# EAGLE design zinthesizer (EAGLE 7.7.0)
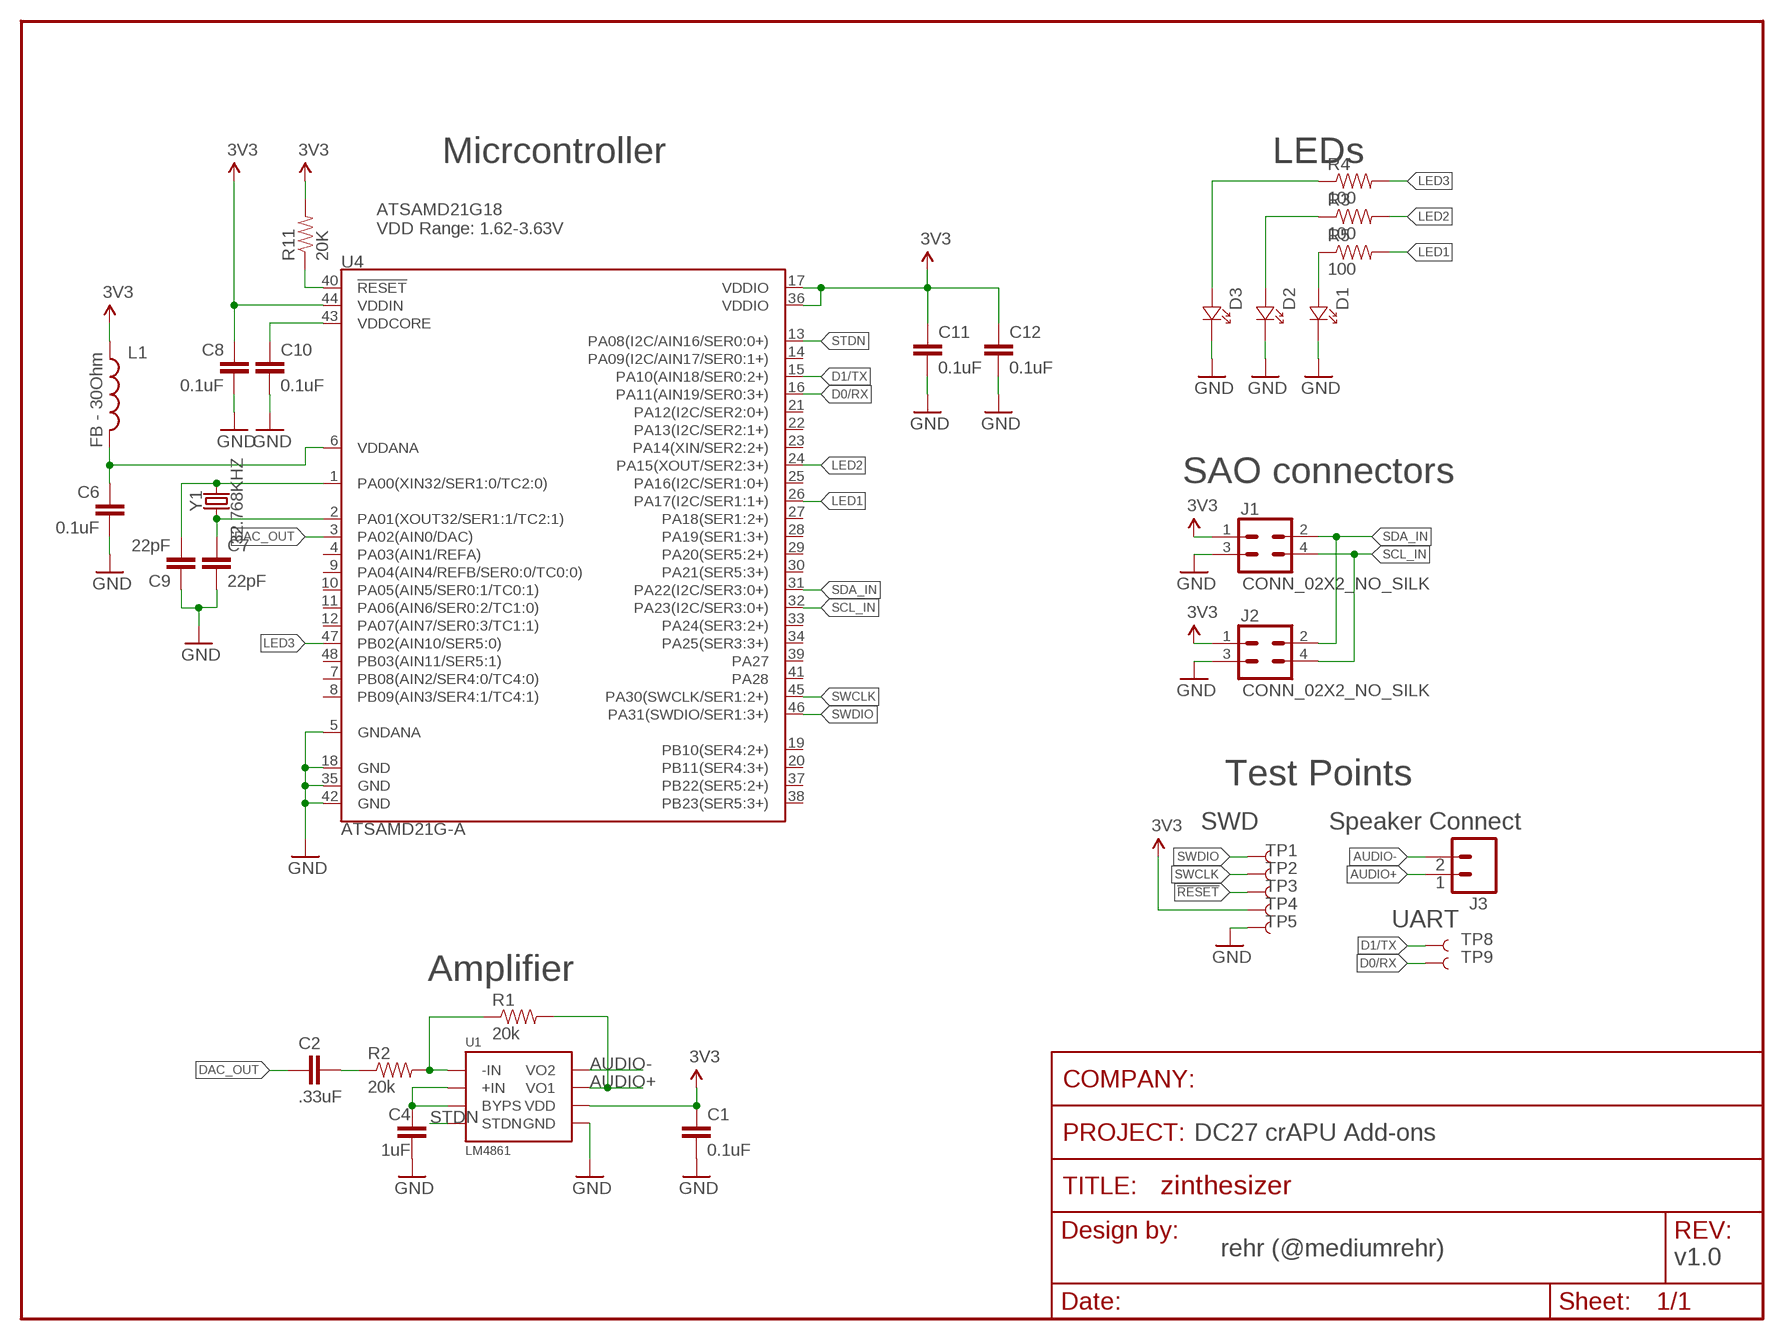
[diagram p0: schematic, sheet 1]

## Parts
C1  0.1uF  CAP0603-CAP  [0603-CAP]
C2  .33uF  CAP0603-CAP  [0603-CAP]
C4  1uF  CAP0603-CAP  [0603-CAP]
C6  0.1uF  0.1UF-25V(+80/-20%)(0603)  [0603-CAP]
C7  22pF  15PF-50V-5%(0603)  [0603-CAP]
C8  0.1uF  0.1UF-25V(+80/-20%)(0603)  [0603-CAP]
C9  22pF  15PF-50V-5%(0603)  [0603-CAP]
C10  0.1uF  0.1UF-25V(+80/-20%)(0603)  [0603-CAP]
C11  0.1uF  0.1UF-25V(+80/-20%)(0603)  [0603-CAP]
C12  0.1uF  0.1UF-25V(+80/-20%)(0603)  [0603-CAP]
D1  LED1206REVERSE_NO_SILK  [1206_NO_SILK]
D2  LED1206REVERSE_NO_SILK  [1206_NO_SILK]
D3  LED1206REVERSE_NO_SILK  [1206_NO_SILK]
FRAME1  FRAME-LETTER-BLANKNO_PACKAGE  [DUMMY]
J1  CONN_02X2_NO_SILK  [2X2_NO_SILK]
J2  CONN_02X2_NO_SILK  [2X2_NO_SILK]
J3  M02ROUND  [M02_ROUND]
L1  FB - 30Ohm  INDUCTOR0603  [0603]
R1  20k  RESISTOR0805-RES  [0805]
R2  20k  RESISTOR0805-RES  [0805]
R3  100  10KOHM-1/10W-1%(0603)0603  [0603-RES]
R4  100  10KOHM-1/10W-1%(0603)0603  [0603-RES]
R5  100  10KOHM-1/10W-1%(0603)0603  [0603-RES]
R11  20K  10KOHM-1/10W-1%(0603)0603  [0603-RES]
TP1  TEST-POINT3X5  [PAD.03X.05]
TP2  TEST-POINT3X5  [PAD.03X.05]
TP3  TEST-POINT3X5  [PAD.03X.05]
TP4  TEST-POINT3X5  [PAD.03X.05]
TP5  TEST-POINT3X5  [PAD.03X.05]
TP8  TEST-POINT3X4  [PAD.03X.04]
TP9  TEST-POINT3X4  [PAD.03X.04]
U1  LM4861  [8-SOIC]
U4  ATSAMD21G-A  [TQFP-48]
Y1  32.768KHZ  ABS06-127-32.768KHZ  [ABS06]

## Nets
3.3V: C1.1 C8.1 C11.1 C12.1 J1.1 J2.1 L1.1 R11.2 TP4.P$1 U1.P$6(VDD) U4.17(VDDIO) U4.36(VDDIO) U4.44(VDDIN) ; supply symbol labelled 3V3
!RESET: R11.1 TP3.P$1 U4.40(!RESET!)
AUDIO+: J3.P$1 R1.2 U1.P$5(VO1)
AUDIO-: J3.P$2 U1.P$8(VO2)
D0/RX: TP9.P$1 U4.16(PA11(AIN19/SER0:3+))
D1/TX: TP8.P$1 U4.15(PA10(AIN18/SER0:2+))
DAC_OUT: C2.2 U4.3(PA02(AIN0/DAC))
GND: C1.2 C4.2 C6.2 C7.2 C8.2 C9.1 C10.2 C11.2 C12.2 D1.P$1 D2.P$1 D3.P$1 J1.3 J2.3 TP5.P$1 U1.P$7(GND) U4.5(GNDANA) U4.18(GND) U4.35(GND) U4.42(GND)
LED1: R5.2 U4.26(PA17(I2C/SER1:1+))
LED2: R3.2 U4.24(PA15(XOUT/SER2:3+))
LED3: R4.2 U4.47(PB02(AIN10/SER5:0))
N$1: C2.1 R2.1
N$2: R1.1 R2.2 U1.P$4(-IN)
N$3: D1.P$2 R5.1
N$4: C7.1 U4.2(PA01(XOUT32/SER1:1/TC2:1)) Y1.P$1
N$5: C4.1 U1.P$2(BYPS) U1.P$3(+IN)
N$6: D2.P$2 R3.1
N$7: D3.P$2 R4.1
N$9: C9.2 U4.1(PA00(XIN32/SER1:0/TC2:0)) Y1.P$2
SCL_IN: J1.4 J2.4 U4.32(PA23(I2C/SER3:0+))
SDA_IN: J1.2 J2.2 U4.31(PA22(I2C/SER3:0+))
STDN: U1.P$1(STDN) U4.13(PA08(I2C/AIN16/SER0:0+))
SWCLK: TP2.P$1 U4.45(PA30(SWCLK/SER1:2+))
SWDIO: TP1.P$1 U4.46(PA31(SWDIO/SER1:3+))
VDDANA: C6.1 L1.2 U4.6(VDDANA)
VDDCORE: C10.1 U4.43(VDDCORE)
Unconnected: U4.4(PA03(AIN1/REFA)) U4.7(PB08(AIN2/SER4:0/TC4:0)) U4.8(PB09(AIN3/SER4:1/TC4:1)) U4.9(PA04(AIN4/REFB/SER0:0/TC0:0)) U4.10(PA05(AIN5/SER0:1/TC0:1)) U4.11(PA06(AIN6/SER0:2/TC1:0)) U4.12(PA07(AIN7/SER0:3/TC1:1)) U4.14(PA09(I2C/AIN17/SER0:1+)) U4.19(PB10(SER4:2+)) U4.20(PB11(SER4:3+)) U4.21(PA12(I2C/SER2:0+)) U4.22(PA13(I2C/SER2:1+)) U4.23(PA14(XIN/SER2:2+)) U4.25(PA16(I2C/SER1:0+)) U4.27(PA18(SER1:2+)) U4.28(PA19(SER1:3+)) U4.29(PA20(SER5:2+)) U4.30(PA21(SER5:3+)) U4.33(PA24(SER3:2+)) U4.34(PA25(SER3:3+)) U4.37(PB22(SER5:2+)) U4.38(PB23(SER5:3+)) U4.39(PA27) U4.41(PA28) U4.48(PB03(AIN11/SER5:1))

## Notes on the sheet
- Micrcontroller | LEDs
- ATSAMD21G18
  VDD Range: 1.62-3.63V
- SAO connectors
- Test Points
- SWD | Speaker Connect
- UART
- Amplifier
- DC27 crAPU Add-ons
- rehr (@mediumrehr)
- v1.0

## Library data of the parts
C1 C2 C4 = SparkFun-Passives:CAP: Capacitor Standard 0603 ceramic capacitor, and 0.1" leaded capacitor.
C6 C8 C10-C12 = SparkFun-Capacitors:0.1UF-25V(+80/-20%)(0603): CAP-00810 Ceramic Standard decoupling cap; PROD_ID: CAP-00810
C7 C9 = SparkFun-Capacitors:15PF-50V-5%(0603): CAP-07881; PROD_ID: CAP-07881; VALUE: 15pF
D1-D3 = IDEO-Diodes:LED1206
FRAME1 = SparkFun-Aesthetics:FRAME-LETTER-BLANK: Schematic Frame - Letter Standard 8.5x11 US Letter frame; DESIGNER: Nobody; VERSION: v01
J1 J2 = SparkFun-Connectors:CONN_02X2
J3 = IDEO-Connectors:M02
L1 = SparkFun-Passives:INDUCTOR: Inductors Basic Inductor/Choke - 0603 and 1206. Footprints are not proven and vary greatly between part numbers. INDUCTOR POWER 3.3UH 4.0A SMD 0.197" L x 0.197" W x 0.177" H (5.00mm x 5.00mm x 4.50mm); PROD_ID: RES-07859
R1 R2 = SparkFun-Passives:RESISTOR: Resistor Basic schematic elements and footprints for 0603, 1206, and PTH resistors.
R3-R5 R11 = SparkFun-Resistors:10KOHM-1/10W-1%(0603): RES-00824; PROD_ID: RES-00824; VALUE: 10K
TP1-TP5 TP8 TP9 = SparkFun-Connectors:TEST-POINT: SparkFun Test Points Bare copper test points for troubleshooting or In-Circuit-Testing. These are used by our Production team for verifying production board runs using pogo-pins on test beds. SparkFun Products: SparkFun LSM9DS1 Breakout <https://www.sparkfun.com/products/13284> SparkFun PSOC <https://www.sparkfun.com/products/13714> SparkFun Load Cell Amplifier <https://www.sparkfun.com/products/13879>
U1 = IDEO-ICs:LM4861
U4 = samd21-temp:ATSAMD21G: Atmel SAMD21G SMART ARM-Based Microcontroller The Atmel ® | SMART ™ SAM D21 is a series of low-power microcontrollers using the 32-bit ARM ® Cortex ® -M0+ processor, and ranging from 32- to 64-pins with up to 256KB Flash and 32KB of SRAM. The SAM D21 devices operate at a maximum frequency of 48MHz and reach 2.46 CoreMark/MHz. They are designed for simple and intuitive migration with identical peripheral modules, hex compatible code, identical linear address map and pin compatible migration paths between all devices in the product series. All devices include intelligent and flexible peripherals, Atmel Event System for inter-peripheral signaling, and support for capacitive touch button, slider and wheel user interfaces.; PROD_ID: IC-13064
Y1 = IDEO-Clocks:ABS06-127-32.768KHZ

## Board
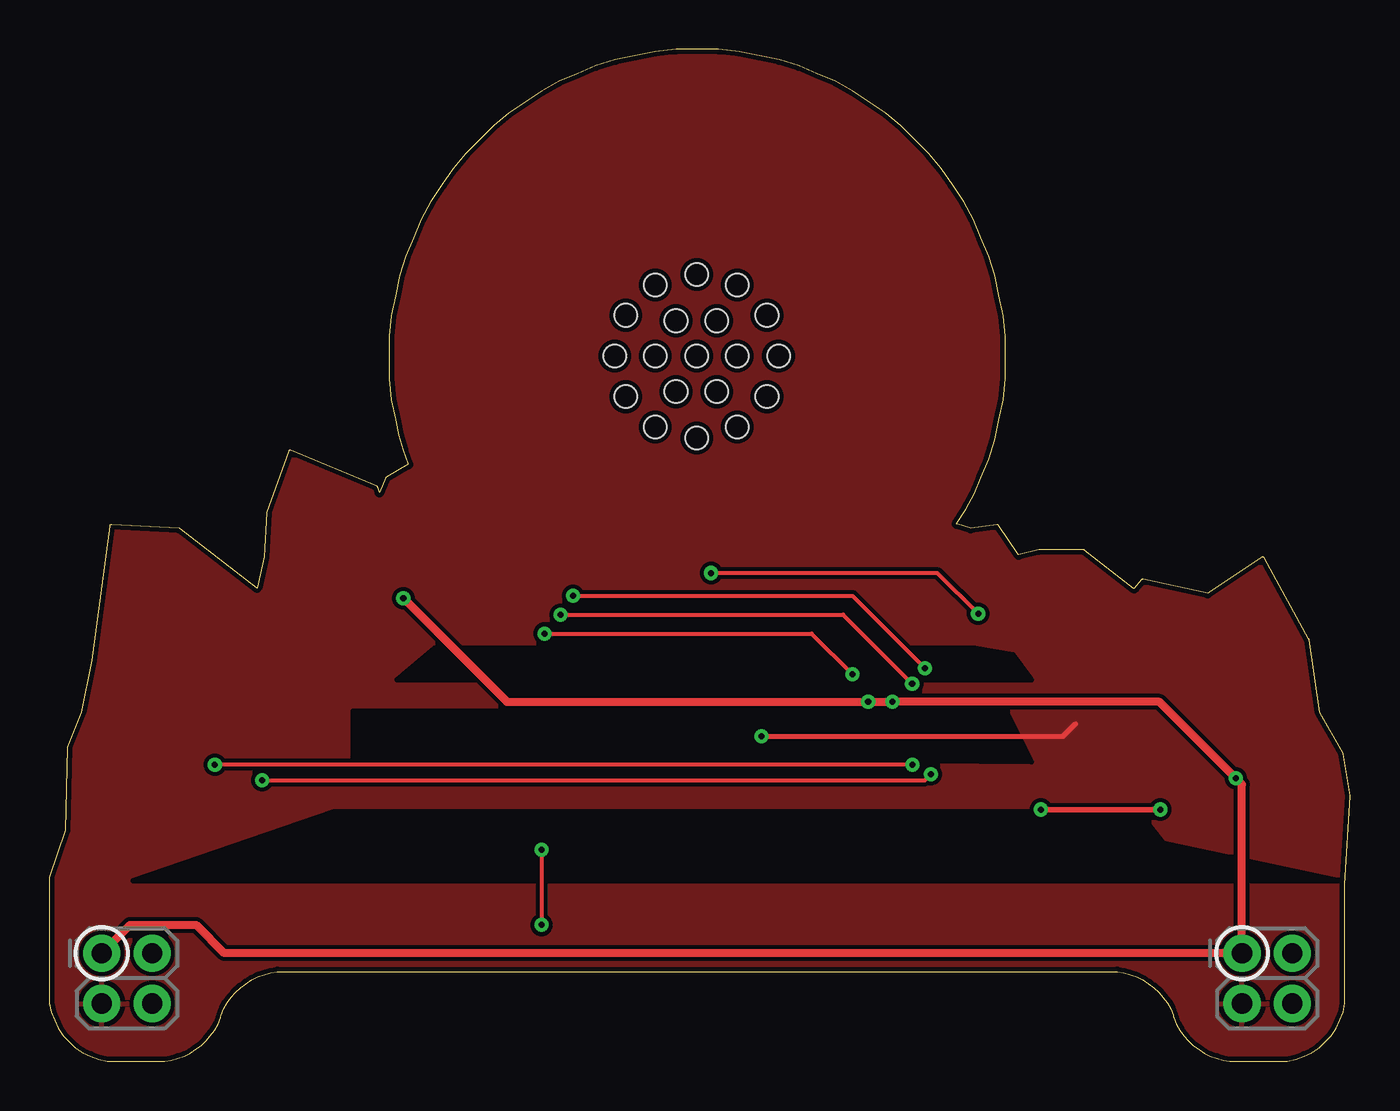
[diagram p1: board, top side]
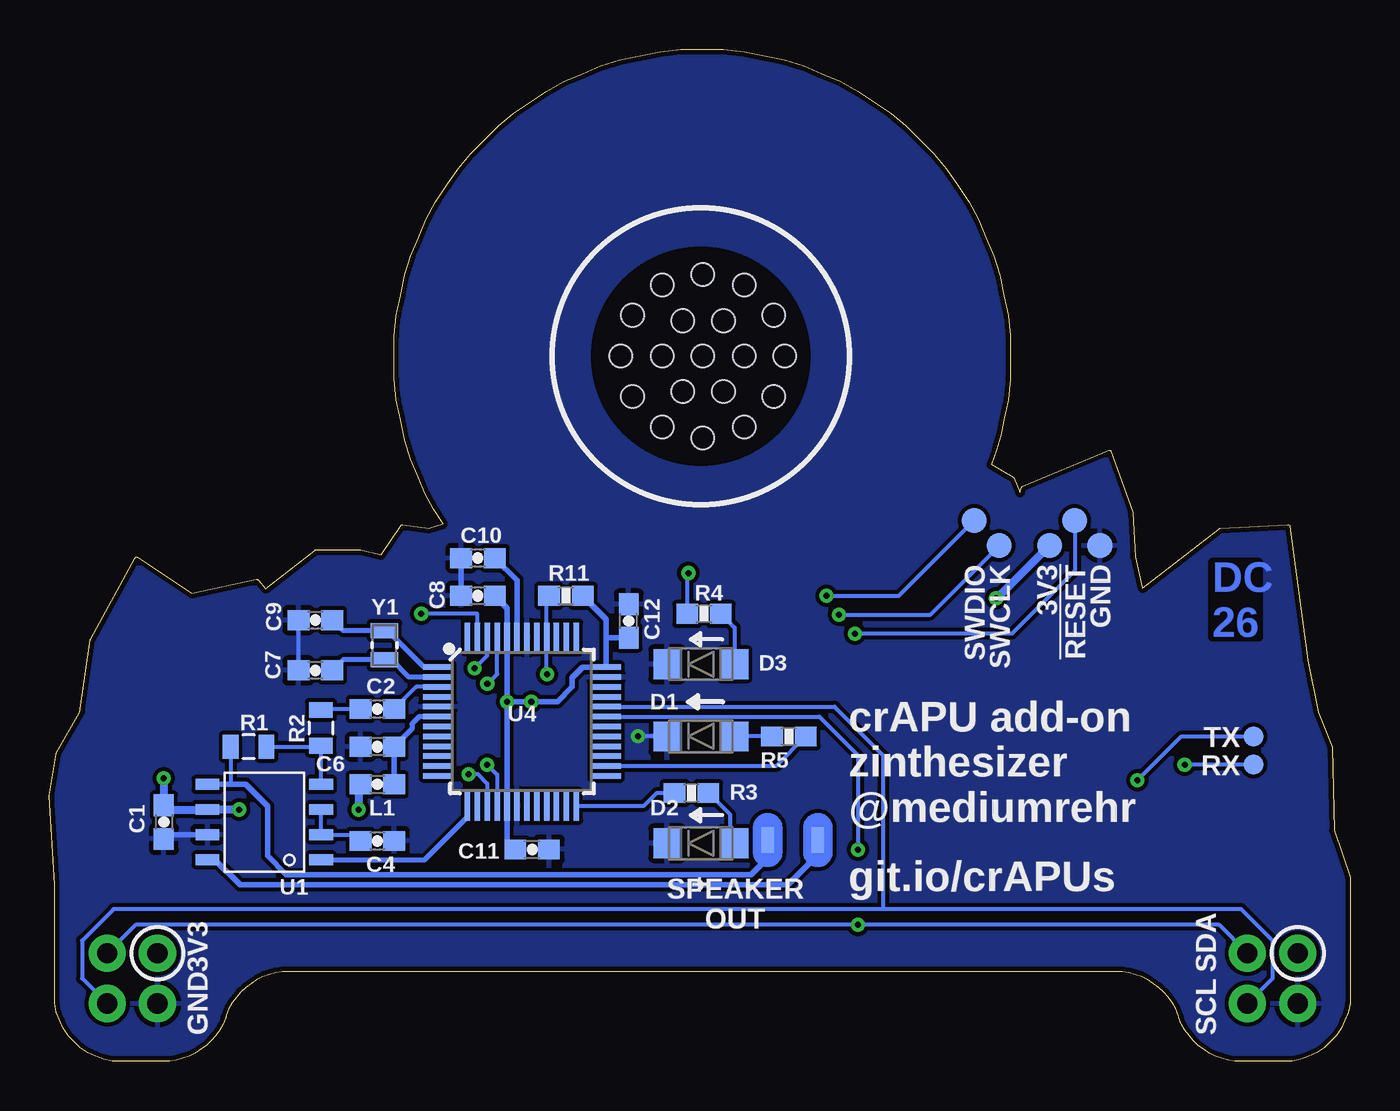
[diagram p2: board, bottom side, seen from below]

Size 65.73 x 51.12 mm. Coordinates in mm from the lower left corner, seen from the top.
Outline: 65.39,15.54 65.39,15.55 65.38,15.56 64.19,17.64 63.66,21.3 63.66,21.31 63.66,21.32 63.65,21.33 61.41,25.43 61.4,25.44 61.4,25.44 61.4,25.44 61.39,25.45 61.37,25.47 61.35,25.47 61.35,25.47 61.35,25.48 61.35,25.48 61.35,25.48 61.35,25.48 61.35,25.48 61.35,25.48 61.34,25.48 61.34,25.48 61.32,25.48 61.3,25.47 61.29,25.47 61.28,25.46 61.28,25.47 61.28,25.46 58.53,23.64 55.28,24.35 55.27,24.35 55.27,24.35 55.27,24.35 55.27,24.35 55.27,24.35 55.27,24.35 55.27,24.36 55.26,24.35 55.26,24.35 55.25,24.35 55.23,24.35 55.22,24.35 55.22,24.34 55.21,24.34 55.21,24.34 55.2,24.33 55.19,24.33 55.19,24.33 54.81,23.88 52.31,25.83 52.3,25.84 52.28,25.84 52.26,25.84 50,25.84 48.98,25.59 47.96,27.07 47.94,27.1 47.91,27.12 47.88,27.11 46.56,26.93 45.85,27.16 46.32,27.89 46.74,28.67 47.08,29.49 47.48,30.42 47.78,31.4 47.99,32.41 48.2,33.43 48.31,34.48 48.31,36.63 48.2,37.68 47.99,38.69 47.78,39.7 47.48,40.68 47.08,41.61 46.69,42.54 46.21,43.43 45.65,44.26 45.09,45.08 44.45,45.86 43.75,46.56 43.04,47.27 42.27,47.9 41.44,48.46 40.61,49.02 39.73,49.5 38.8,49.9 37.87,50.29 36.89,50.6 35.88,50.8 34.86,51.01 33.81,51.12 31.66,51.12 30.61,51.01 29.6,50.8 28.59,50.6 27.61,50.29 26.68,49.9 25.75,49.5 24.86,49.02 24.03,48.46 23.2,47.9 22.43,47.27 21.73,46.56 21.02,45.86 20.39,45.08 19.83,44.26 19.27,43.43 18.79,42.54 18.39,41.61 18,40.68 17.69,39.7 17.48,38.69 17.28,37.68 17.17,36.63 17.17,34.48 17.28,33.43 17.48,32.41 17.64,31.64 17.86,30.88 18.13,30.15 17.02,29.52 17.01,29.51 16.99,29.49 16.99,29.48 16.68,28.74 16.6,28.99 16.59,29.02 16.58,29.04 16.55,29.05 12.19,30.87 12.17,30.88 12.15,30.88 12.12,30.87 12.1,30.86 12.08,30.84 12.08,30.82 10.99,27.75 10.99,27.74 10.98,27.74 10.98,27.73 10.86,25.49 10.49,23.91 6.6,26.91 6.58,26.92 6.57,26.93 6.55,26.93 3.14,27.12 3.09,27.12 3.05,27.08 3.04,27.04 2.14,20.27 1.59,17.64 0.91,15.88 0.91,15.87 0.9,15.86 0.9,15.85 0.8,11.67 0,9.29 0,2.93 0.1,2.48 0.27,2.07 0.44,1.67 0.69,1.3 1.3,0.69 1.67,0.44 2.07,0.27 2.48,0.09 2.93,0 5.82,0 6.16,0.05 6.49,0.16 6.81,0.26 7.12,0.41 7.4,0.6 7.67,0.8 7.92,1.03 8.13,1.3 8.35,1.57 8.52,1.87 8.64,2.2 8.65,2.23 8.66,2.26 8.68,2.29 8.69,2.32 8.81,2.66 8.98,2.96 9.2,3.23 9.41,3.5 9.66,3.73 9.93,3.92 10.21,4.11 10.52,4.27 10.84,4.37 11.17,4.47 11.51,4.53 53.96,4.53 54.31,4.47 54.63,4.37 54.96,4.27 55.26,4.11 55.54,3.92 55.82,3.73 56.07,3.5 56.28,3.23 56.49,2.96 56.66,2.66 56.79,2.32 56.8,2.29 56.81,2.26 56.82,2.23 56.83,2.2 56.96,1.87 57.13,1.57 57.34,1.3 57.55,1.03 57.8,0.8 58.08,0.6 58.36,0.41 58.66,0.26 58.99,0.16 59.32,0.05 59.66,0 62.55,0 62.99,0.09 63.4,0.27 63.81,0.44 64.17,0.69 64.48,0.99 64.79,1.3 65.04,1.67 65.21,2.07 65.38,2.48 65.48,2.93 65.48,8.93 65.73,13.42 65.4,15.53 65.39,15.54
Copper layers (1*16): Top 0.035mm / dielectric 1.5mm / Bottom 0.035mm
Design rules "default *": minimum track width 6mil, minimum drill 12mil, track to track 8mil, track to pad 8mil, pad to pad 8mil, via to via 8mil, smd to smd 8mil, copper to edge 10mil, drill to drill 8mil, minimum pad ring 10mil, minimum via ring 8mil, stop-mask expansion 4mil, vias tented up to drill 13mil, thermal gap 10mil
Holes 1.14 mm at 32.71,35.64 30.62,35.64 28.57,35.64 34.76,35.64 36.85,35.64 33.72,37.42 31.67,37.42 31.67,33.83 33.72,33.83 36.26,33.58 34.76,32.06 32.71,31.5 30.62,32.06 29.13,33.58 29.13,37.69 30.62,39.22 32.71,39.75 34.76,39.22 36.26,37.69
bRestrict: area 27.4,30.2 to 38.2,41

### Footprints (pad centres in the part's own frame; a part is rotated, then mirrored left to right if it is on the bottom)
0603-CAP = smd 1.1 x 1: 1 -0.85,0; 2 0.85,0
1206_NO_SILK = smd 1.4 x 1.5: P$1 -1.7,0; P$2 1.7,0
2X2_NO_SILK = drill 1.016 pad 1.88: 1 1.27,1.27; 2 1.27,3.81; 3 3.81,1.27; 4 3.81,3.81
M02_ROUND = smd 1.27 x 0.635: P$1 0,1.27; P$2 0,-1.27
0603 = smd 1.1 x 1: 1 -0.85,0; 2 0.85,0
0805 = smd 0.8 x 1.2: 1 -0.9,0; 2 0.9,0
0603-RES = smd 1.1 x 1: 1 -0.85,0; 2 0.85,0
PAD.03X.05 = smd 1.27 x 1.27: P$1 0,0
PAD.03X.04 = smd 1.016 x 1.016: P$1 0,0
8-SOIC = smd 0.55 x 1.2: P$1 -1.905,-2.87; P$2 -0.635,-2.87; P$3 0.635,-2.87; P$4 1.905,-2.87; P$5 1.905,2.87; P$6 0.635,2.87; P$7 -0.635,2.87; P$8 -1.905,2.87
TQFP-48 = smd 1.5 x 0.28: 1 -4.25,2.75; 2 -4.25,2.25; 3 -4.25,1.75; 4 -4.25,1.25; 5 -4.25,0.75; 6 -4.25,0.25; 7 -4.25,-0.25; 8 -4.25,-0.75; 9 -4.25,-1.25; 10 -4.25,-1.75; 11 -4.25,-2.25; 12 -4.25,-2.75; 25 4.25,-2.75; 26 4.25,-2.25; 27 4.25,-1.75; 28 4.25,-1.25; 29 4.25,-0.75; 30 4.25,-0.25; 31 4.25,0.25; 32 4.25,0.75; 33 4.25,1.25; 34 4.25,1.75; 35 4.25,2.25; 36 4.25,2.75 | smd 0.28 x 1.5: 13 -2.75,-4.25; 14 -2.25,-4.25; 15 -1.75,-4.25; 16 -1.25,-4.25; 17 -0.75,-4.25; 18 -0.25,-4.25; 19 0.25,-4.25; 20 0.75,-4.25; 21 1.25,-4.25; 22 1.75,-4.25; 23 2.25,-4.25; 24 2.75,-4.25; 37 2.75,4.25; 38 2.25,4.25; 39 1.75,4.25; 40 1.25,4.25; 41 0.75,4.25; 42 0.25,4.25; 43 -0.25,4.25; 44 -0.75,4.25; 45 -1.25,4.25; 46 -1.75,4.25; 47 -2.25,4.25; 48 -2.75,4.25
ABS06 = smd 0.762 x 1.397: P$1 -0.737,0; P$2 0.737,0

### Placement (x,y rotation side)
C1  59.95,12.09 270 bottom
C2  49.16,17.8 0 bottom
C4  49.16,11.14 0 bottom
C6  49.16,15.9 180 bottom
C7  52.29,19.75 180 bottom
C8  44.08,23.52 180 bottom
C9  52.29,22.29 0 bottom
C10  44.08,25.42 180 bottom
C11  41.34,10.7 0 bottom
C12  36.46,22.25 90 bottom
D1  32.81,16.42 0 bottom
D2  32.81,11.02 0 bottom
D3  32.81,20.07 0 bottom
FRAME1  -5.29,-8.35 0 top  (outside the outline)
J1  1.38,6.73 270 top
J2  59,6.73 270 top
J3  28.16,11.18 90 bottom
L1  49.16,13.99 0 bottom
R1  55.67,15.9 180 bottom
R2  52.01,16.85 270 bottom
R3  33.28,13.56 180 bottom
R4  32.65,22.61 180 bottom
R5  28.36,16.42 0 bottom
R11  39.63,23.52 0 bottom
TP1  18.99,27.33 0 bottom
TP2  17.72,26.06 0 bottom
TP3  13.91,27.33 0 bottom
TP4  15.18,26.06 0 bottom
TP5  12.64,26.06 0 bottom
TP8  4.87,16.42 0 bottom
TP9  4.87,14.99 0 bottom
U1  54.87,12.09 90 bottom
U4  41.85,17.17 0 bottom
Y1  48.8,21.02 90 bottom

### Tracks (layer width: path | path; a pad name or v marks a point on that pad's centre or on a via)
3.3V  (via drill 0.3)
  Top 0.279: v50.11,12.72 v56.14,12.72
  Top 0.406: J1.1 4.07,6.89 7.41,6.89 8.84,5.46 J2.1 60.27,13.99 v59.95,14.31 56.1,18.16 v42.6,18.16 v41.38,18.16 23.12,18.16 v17.89,23.4
  Bottom 0.203: 59.74,12.72 C1.1
  Bottom 0.254: 17.84,23.4 v17.89,23.4
  Bottom 0.279: C8.1 42.6,22.9 U4.44 v42.6,18.16 | v42.6,18.16 40.06,18.16 39.31,18.91 39.31,19.39 38.79,19.92 U4.36 37.6,21.4 | v42.6,18.16 U4.17 42.6,10.75 42.33,10.7 C11.1 | 37.6,21.4 37.6,22.34 R11.2 | C12.1 37.6,21.4
  Bottom 0.406: v56.14,12.72 U1.P$6 59.74,12.72 | L1.1 50.11,13.89 v50.11,12.72 | v59.95,14.31 C1.1 | TP4.P$1 17.84,23.4
!RESET  (via drill 0.3)
  Top 0.203: v25.03,21.61 38.52,21.61 v40.58,19.55
  Bottom 0.203: R11.1 40.6,23.4 U4.40 40.6,19.57 v40.58,19.55 | TP3.P$1 13.91,24.79 17.09,21.61 v25.03,21.61
AUDIO+
  Bottom 0.203: U1.P$5 57.41,13.99 | R1.2 56.57,13.99 57.09,13.99
  Bottom 0.279: 57.41,13.99 57.09,13.99 55.82,13.99 54.71,12.88 54.72,12.88 54.72,10.38 53.76,9.43 30.27,9.43 29.63,10.07 29.63,10.98 J3.P$1
AUDIO-
  Bottom 0.203: 26.93,11.14 J3.P$2
  Bottom 0.279: 57.57,10.18 U1.P$8 57.37,10.18 56.1,8.91 28.41,8.91 26.93,10.38 26.93,11.14
D0/RX  (via drill 0.3)
  Top 0.203: v43.6,14.99 v8.36,14.99
  Bottom 0.203: TP9.P$1 v8.36,14.99 | v43.6,14.99 43.1,14.49 U4.16
D1/TX  (via drill 0.3)
  Top 0.203: v10.74,14.19 44.24,14.19 v44.56,14.51
  Bottom 0.203: U4.15 43.6,14.03 44.08,14.51 v44.56,14.51 | v10.74,14.19 8.52,16.42 TP8.P$1
DAC_OUT
  Bottom 0.203: 48.15,17.65 C2.2 47.19,18.92 U4.3
GND  (via drill 0.3)
  Top 0.254: v35.98,16.42 51.22,16.42 51.86,17.05
  Bottom 0.203: 59.74,11.45 C1.2 | C7.2 C9.1 | D1.P$1 v35.98,16.42
  Bottom 0.279: U1.P$7 59.74,11.45 | C8.2 C10.2
  pour Bottom: -1.48,1.81 2.33,29.75 9.95,27.21 11.22,32.29 16.3,31.02 16.3,36.1 arc-90 32.81,52.61 arc-90 49.32,36.1 49.32,33.56 48.05,28.48 58.21,24.67 62.02,27.21 67.1,15.78 67.1,1.81 64.56,-0.73 58.21,-0.73 54.4,3.08 11.22,3.08 7.41,-0.73 1.06,-0.73
  pour Top: -1.48,6.89 2.33,28.48 9.95,27.21 11.22,32.29 16.3,31.02 16.3,38.64 arc-90 30.27,52.61 32.81,52.61 35.35,52.61 arc-90 50.59,37.37 50.59,27.21 62.02,27.21 68.37,15.78 67.1,0.54 62.02,-2 55.67,0.54 53.13,3.08 11.22,3.08 7.41,-0.73 -0.21,-0.73
LED1
  Bottom 0.203: R5.2 29.01,14.92 U4.26
LED2
  Bottom 0.203: U4.24 35.67,12.92 35.03,13.56 R3.2
LED3  (via drill 0.3)
  Top 0.203: v46.94,22.61 44.87,24.67 v33.44,24.67
  Bottom 0.203: U4.47 44.1,22.61 v46.94,22.61 | v33.44,24.67 33.5,24.61 R4.2
N$1
  Bottom 0.203: R2.1 51.96,17.8 C2.1
N$2
  Bottom 0.203: R1.1 52.07,15.9 R2.2 52,15.94 U1.P$4
N$3
  Bottom 0.203: R5.1 D1.P$2
N$4
  Bottom 0.203: 50.91,20.29 C7.1
  Bottom 0.254: Y1.P$1 50.91,20.29 | 49.06,20.29 Y1.P$1 | U4.2 47.56,19.42 48.43,20.29 Y1.P$1
N$5
  Bottom 0.203: C4.1 50.01,11.45 U1.P$2 U1.P$3
N$6
  Bottom 0.203: 31.32,11.02 31.32,12.45 R3.1
  Bottom 0.279: D2.P$2 31.32,11.02
N$7
  Bottom 0.203: R4.1 31.11,21.92 D3.P$2
N$8
  cutout Top: 4.23,9.11 14.39,12.61 55.03,12.61 56.3,11.02 65.19,9.11
N$9
  Bottom 0.203: 50.91,21.76 C9.2
  Bottom 0.254: 50.91,21.76 Y1.P$2 48.63,21.76 46.79,19.92 U4.1
N$10
  cutout Top: 15.35,17.69 15.35,15.46 49.64,15.15 48.37,17.69
N$11
  cutout Top: 19.47,20.86 17.57,19.27 49.64,19.27 48.68,20.54 46.78,20.86
SCL_IN
  Bottom 0.203: J1.4 3.92,4.19 3.92,6.1 5.5,7.68 23.6,7.68 | 23.6,7.68 62.49,7.68 64.08,6.1 64.08,4.19 J2.4 | 23.6,7.68 23.6,15.46 26.06,17.92 U4.32
SDA_IN  (via drill 0.3)
  Top 0.203: v24.87,10.7 v24.87,6.89
  Bottom 0.203: J1.2 6.61,6.89 v24.87,6.89 61.38,6.89 J2.2 | v24.87,10.7 24.87,15.46 26.83,17.42 U4.31
STDN
  Bottom 0.203: 44.6,12.35 U4.13
  Bottom 0.254: U1.P$1 46.78,10.18 44.6,12.35
SWCLK  (via drill 0.3)
  Top 0.203: v25.82,22.57 40.11,22.57 v43.6,19.07
  Bottom 0.203: U4.45 43.1,19.57 v43.6,19.07 | v25.82,22.57 21.22,22.57 TP2.P$1
SWDIO  (via drill 0.3)
  Top 0.203: v26.46,23.52 40.58,23.52 v44.24,19.87
  Bottom 0.203: v26.46,23.52 22.8,23.52 TP1.P$1 | v44.24,19.87 43.6,20.5 U4.46
VDDANA
  Bottom 0.254: U4.6 47.05,17.42 47.41,17.05 47.41,16.79 C6.1
  Bottom 0.279: 48.06,16.15 C6.1 L1.2
VDDCORE
  Bottom 0.279: U4.43 42.1,24.3 C10.1

### Text on the board
Bottom: DC / 26
bPlace: GND | !RESET | 3V3 | SWCLK | SWDIO | TX | RX | crAPU add-on / zinthesizer / @mediumrehr | git.io/crAPUs | - | + | SPEAKER / OUT | SDA | 3V3 | SCL | GND